# EAGLE design LedMatrixController (EAGLE 6.5.0)
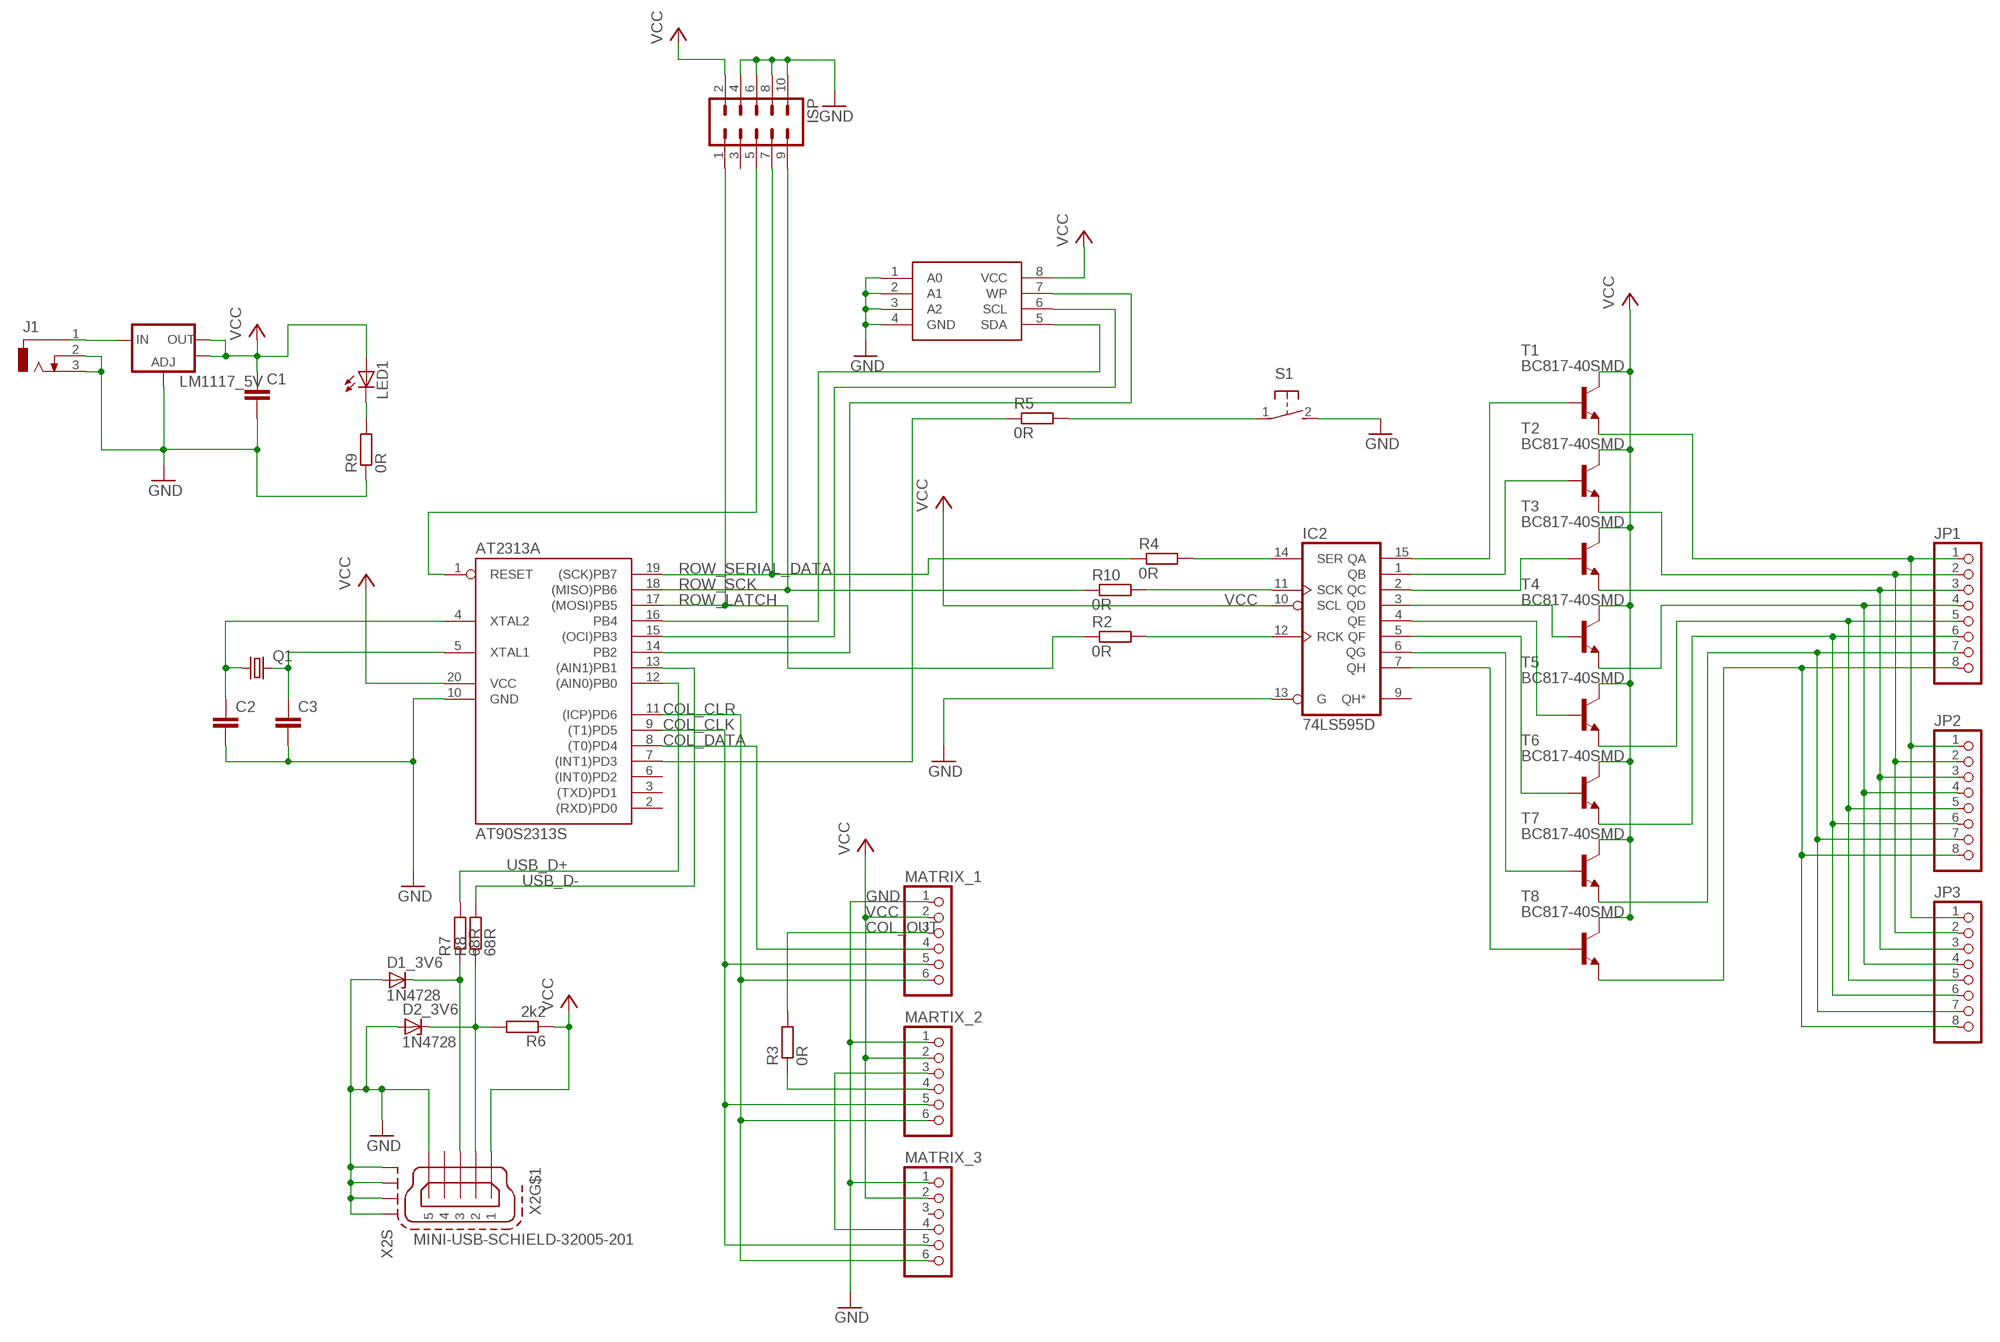
[diagram p0: schematic, sheet 1]

## Parts
AT2313A  AT90S2313S  [SO20L]
C1  C-EU025-025X050  [C025-025X050]
C2  C-EUC1206  [C1206]
C3  C-EUC1206  [C1206]
D1_3V6  1N4728  [DO41Z10]
D2_3V6  1N4728  [DO41Z10]
EEPROM  AT24C08  [SO08]
IC2  74LS595D  [SO16]
ISP  ML10  [ML10]
J1  DCJ0303  [DCJ0303]
JP1  PINHD-1X8  [1X08]
JP2  PINHD-1X8  [1X08]
JP3  PINHD-1X8  [1X08]
LED1  LEDCHIPLED_1206  [CHIPLED_1206]
LM1117_5V  V_REG_LM1117SOT223  [SOT223]
MARTIX_2  PINHD-1X6  [1X06]
MATRIX_1  PINHD-1X6  [1X06]
MATRIX_3  PINHD-1X6  [1X06]
Q1  CRYSTALHC49UP  [HC49UP]
R2  0R  R-EU_R1206  [R1206]
R3  0R  R-EU_R1206  [R1206]
R4  0R  R-EU_R1206  [R1206]
R5  0R  R-EU_R1206  [R1206]
R6  2k2  R-EU_R1206  [R1206]
R7  68R  R-EU_R1206  [R1206]
R8  68R  R-EU_R1206  [R1206]
R9  0R  R-EU_R1206  [R1206]
R10  0R  R-EU_R1206  [R1206]
S1  31-XX  [B3F-31XX]
T1  BC817-40SMD  [SOT23-BEC]
T2  BC817-40SMD  [SOT23-BEC]
T3  BC817-40SMD  [SOT23-BEC]
T4  BC817-40SMD  [SOT23-BEC]
T5  BC817-40SMD  [SOT23-BEC]
T6  BC817-40SMD  [SOT23-BEC]
T7  BC817-40SMD  [SOT23-BEC]
T8  BC817-40SMD  [SOT23-BEC]
X2  MINI-USB-SCHIELD-32005-201  [32005-201]

## Nets
COL_CLK: AT2313A.9((T1)PD5) MARTIX_2.5 MATRIX_1.5 MATRIX_3.5
COL_CLR: AT2313A.11((ICP)PD6) MARTIX_2.6 MATRIX_1.6 MATRIX_3.6
COL_DATA: AT2313A.8((T0)PD4) MATRIX_1.4
COL_OUT: MATRIX_1.3 R3.2
COL_OUT_2: MARTIX_2.4 R3.1
GND: AT2313A.10(GND) C1.2 C2.2 C3.2 D1_3V6.A D2_3V6.A EEPROM.1(A0) EEPROM.2(A1) EEPROM.3(A2) EEPROM.4(GND) IC2.13(G) ISP.4 ISP.6 ISP.8 ISP.10 J1.2 J1.3 LM1117_5V.1(ADJ) MARTIX_2.1 MATRIX_1.1 MATRIX_3.1 R9.1 S1.2(S) X2.5 X2.M1(S:S1) X2.M2(S:S2) X2.M3(S:S3) X2.M4(S:S4)
N$1: AT2313A.4(XTAL2) C2.1 Q1.1
N$2: J1.1 LM1117_5V.3(IN)
N$3: AT2313A.5(XTAL1) C3.1 Q1.2
N$4: AT2313A.7((INT1)PD3) R5.1
N$5: IC2.12(RCK) R2.2
N$6: AT2313A.16(PB4) EEPROM.5(SDA)
N$7: IC2.14(SER) R4.2
N$8: MARTIX_2.3 MATRIX_3.4
N$10: AT2313A.15((OCI)PB3) EEPROM.6(SCL)
N$11: IC2.11(SCK) R10.2
N$12: AT2313A.14(PB2) EEPROM.7(WP)
N$13: AT2313A.1(RESET) ISP.5
N$14: R5.2 S1.1(P)
N$17: LED1.C R9.2
R1: IC2.15(QA) T1.B
R2: IC2.1(QB) T2.B
R3: IC2.2(QC) T3.B
R4: IC2.3(QD) T4.B
R5: IC2.4(QE) T5.B
R6: IC2.5(QF) T6.B
R7: IC2.6(QG) T7.B
R8: IC2.7(QH) T8.B
ROW1: JP1.1 JP2.1 JP3.1 T1.E
ROW2: JP1.2 JP2.2 JP3.2 T2.E
ROW3: JP1.3 JP2.3 JP3.3 T3.E
ROW4: JP1.4 JP2.4 JP3.4 T4.E
ROW5: JP1.5 JP2.5 JP3.5 T5.E
ROW6: JP1.6 JP2.6 JP3.6 T6.E
ROW7: JP1.7 JP2.7 JP3.7 T7.E
ROW8: JP1.8 JP2.8 JP3.8 T8.E
ROW_LATCH: AT2313A.17((MOSI)PB5) ISP.1 R2.1
ROW_SCK: AT2313A.18((MISO)PB6) ISP.9 R10.1
ROW_SERIAL_DATA: AT2313A.19((SCK)PB7) ISP.7 R4.1
USB_D+: AT2313A.12((AIN0)PB0) R7.2
USB_D-: AT2313A.13((AIN1)PB1) R8.2
USB_DATA+: D1_3V6.C R7.1 X2.3
USB_DATA-: D2_3V6.C R6.2 R8.1 X2.2
VCC: AT2313A.20(VCC) C1.1 EEPROM.8(VCC) IC2.10(SCL) ISP.2 LED1.A LM1117_5V.2(OUT) LM1117_5V.4(OUT) MARTIX_2.2 MATRIX_1.2 MATRIX_3.2 R6.1 T1.C T2.C T3.C T4.C T5.C T6.C T7.C T8.C X2.1
Unconnected: AT2313A.2((RXD)PD0) AT2313A.3((TXD)PD1) AT2313A.6((INT0)PD2) IC2.9(QH*) ISP.3 MATRIX_3.3 X2.4

## Power pins joined to a net without a drawn wire
+5V: IC2.16(VCC)
GND: IC2.8(GND)

## Library data of the parts
AT2313A = atmel:AT90S2313: MICROCONTROLLER 2 Kbytes FLASH 128 bytes SRAM 128 bytes EEPROM UART; OC_FARNELL: unknown; OC_NEWARK: unknown
C1-C3 = resistor:C-EU: CAPACITOR, European symbol
D1_3V6 D2_3V6 = diode:1N4728: Z DIODE 3.3 V, 1W, 5 percent
EEPROM = MJ:AT24C08
IC2 = 74xx-us:74*595: 8-bit SHIFT REGISTER, output latch
ISP = con-ml:ML10: HARTING; OC_FARNELL: unknown; OC_NEWARK: unknown
J1 = con-jack:DCJ0303: DC POWER JACK Source: DCJ0303.pdf; OC_FARNELL: unknown; OC_NEWARK: unknown
JP1-JP3 = pinhead:PINHD-1X8: PIN HEADER
LED1 = led:LED: LED OSRAM: - CHIPLED LG R971, LG N971, LY N971, LG Q971, LY Q971, LO R971, LY R971 LH N974, LH R974 LS Q976, LO Q976, LY Q976 LO Q996 - Hyper CHIPLED LW Q18S LB Q993, LB Q99A, LB R99A - SideLED LS A670, LO A670, LY A670, LG A670, LP A670 LB A673, LV A673, LT A673, LW A673 LH A674 LY A675 LS A676, LA A676, LO A676, LY A676, LW A676 LS A679, LY A679, LG A679 - Hyper Micro SIDELED® LS Y876, LA Y876, LO Y876, LY Y876 LT Y87S - SmartLED LW L88C, LW L88S LB L89C, LB L89S, LG L890 LS L89K, LO L89K, LY L89K LS L896, LA L896, LO L896, LY L896 - TOPLED LS T670, LO T670, LY T670, LG T670, LP T670 LSG T670, LSP T670, LSY T670, LOP T670, LYG T670 LG T671, LOG T671, LSG T671 LB T673, LV T673, LT T673, LW T673 LH T674 LS T676, LA T676, LO T676, LY T676, LB T676, LH T676, LSB T676, LW T676 LB T67C, LV T67C, LT T67C, LS T67K, LO T67K, LY T67K, LW E67C LS E67B, LA E67B, LO E67B, LY E67B, LB E67C, LV E67C, LT E67C LW T67C LS T679, LY T679, LG T679 LS T770, LO T770, LY T770, LG T770, LP T770 LB T773, LV T773, LT T773, LW T773 LH T774 LS E675, LA E675, LY E675, LS T675 LS T776, LA T776, LO T776, LY T776, LB T776 LHGB T686 LT T68C, LB T68C - Hyper Mini TOPLED® LB M676 - Mini TOPLED Santana® LG M470 LS M47K, LO M47K, LY M47K Source: http://www.osram.convergy.de LUXEON: - LUMILED® LXK2-PW12-R00, LXK2-PW12-S00, LXK2-PW14-U00, LXK2-PW14-V00 LXK2-PM12-R00, LXK2-PM12-S00, LXK2-PM14-U00 LXK2-PE12-Q00, LXK2-PE12-R00, LXK2-PE12-S00, LXK2-PE14-T00, LXK2-PE14-U00 LXK2-PB12-K00, LXK2-PB12-L00, LXK2-PB12-M00, LXK2-PB14-N00, LXK2-PB14-P00, LXK2-PB14-Q00 LXK2-PR12-L00, LXK2-PR12-M00, LXK2-PR14-Q00, LXK2-PR14-R00 LXK2-PD12-Q00, LXK2-PD12-R00, LXK2-PD12-S00 LXK2-PH12-R00, LXK2-PH12-S00 LXK2-PL12-P00, LXK2-PL12-Q00, LXK2-PL12-R00 Source: www.luxeon.com KINGBRIGHT: KA-3528ASYC Source: www.kingbright.com
LM1117_5V = SparkFun-PowerIC:V_REG_LM1117: Voltage Regulator LM1117 Standard adjustable voltage regulator but in SMD form. Spark Fun Electronics SKU : COM-00595; PROD_ID: VREG-08170
MARTIX_2 MATRIX_1 MATRIX_3 = pinhead:PINHD-1X6: PIN HEADER
Q1 = crystal:CRYSTAL: CRYSTAL; OC_FARNELL: unknown; OC_NEWARK: unknown
R2-R10 = resistor:R-EU_: RESISTOR, European symbol
S1 = switch-omron:31-XX: OMRON SWITCH; MPN: B3F-3100; OC_FARNELL: 959704; OC_NEWARK: 36M3582
T1-T8 = transistor-npn:BC817*: NPN Transistor
X2 = con-cypressindustries:MINI-USB-SCHIELD-: MINI USB-B Conector Source: www.cypressindustries.com; OC_FARNELL: unknown; OC_NEWARK: unknown

## Board
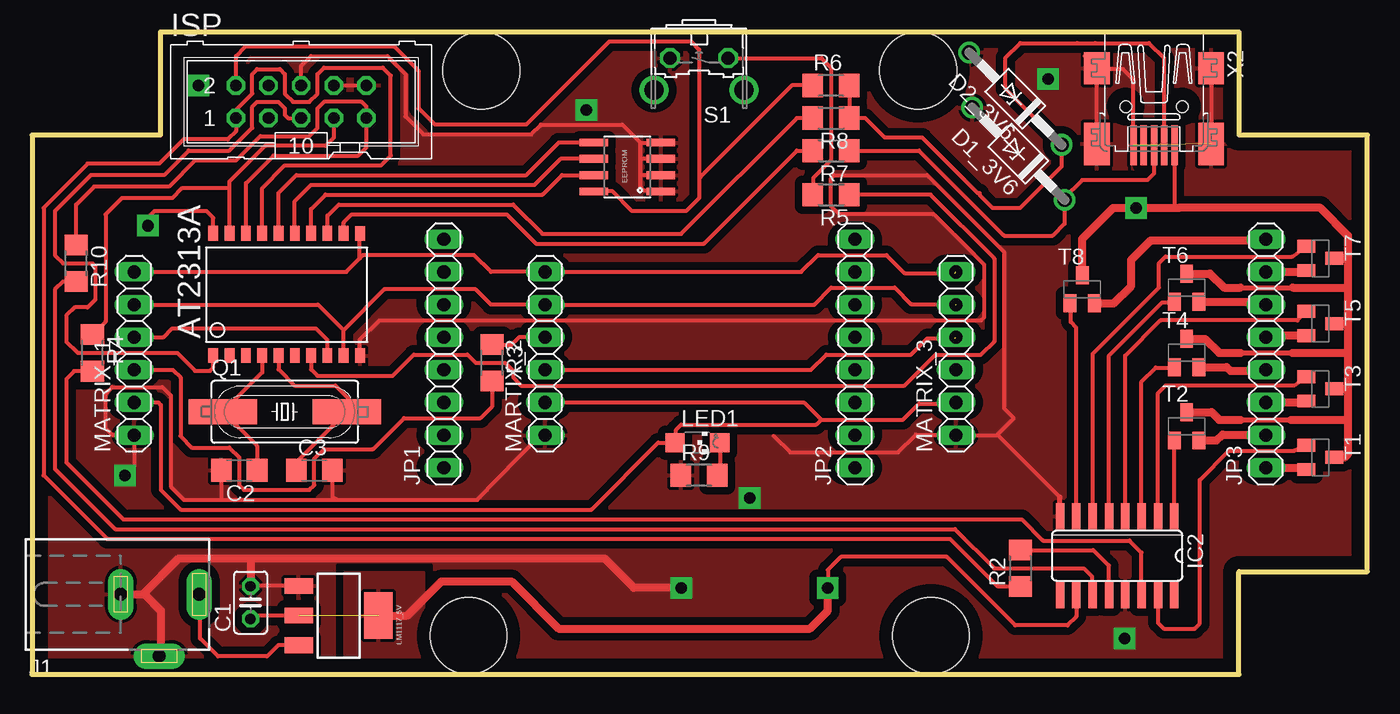
[diagram p1: board, top side]
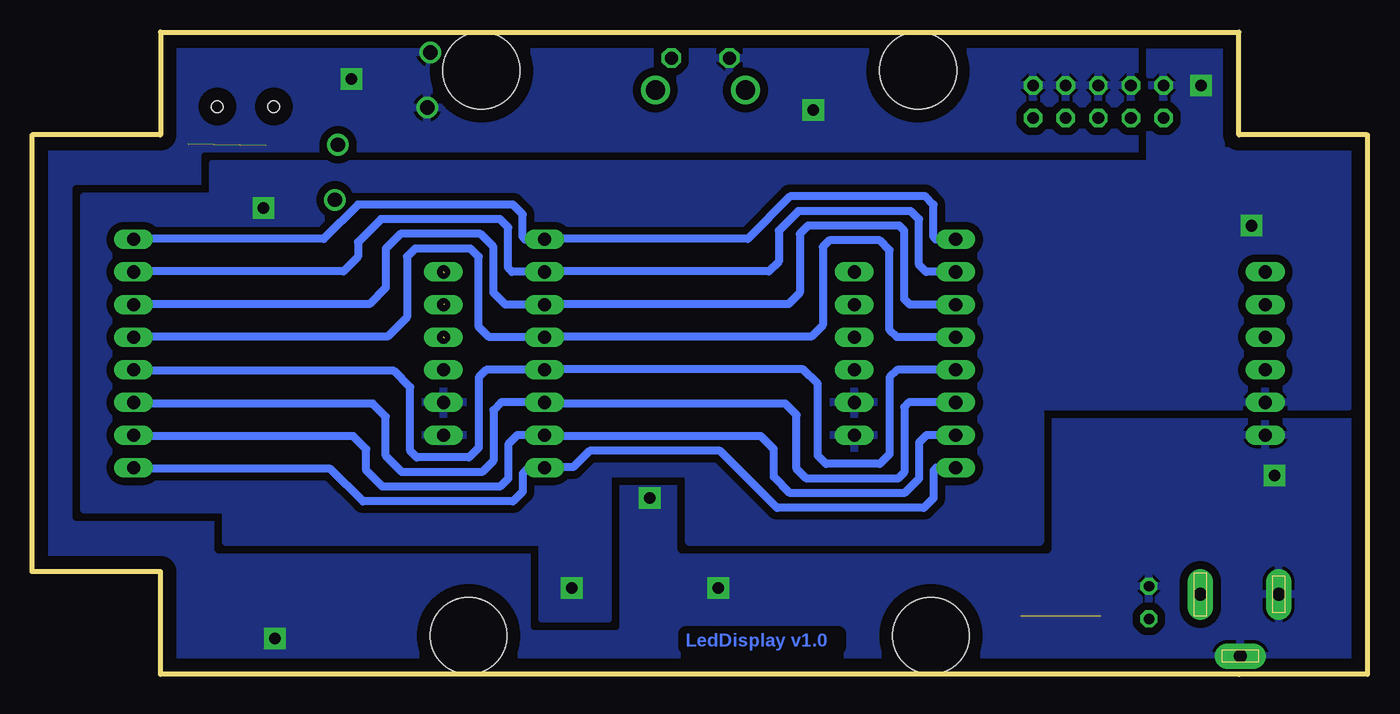
[diagram p2: board, bottom side, seen from below]

Size 104 x 50 mm. Coordinates in mm from the lower left corner, seen from the top.
Outline: 104,8 104,42 94,42 94,50 10,50 10,42 0,42 0,0 10,0 10,0 94,0 94,8 104,8
Copper layers (1*16): Top 0.035mm / dielectric 1.5mm / Bottom 0.035mm
Design rules "default *": minimum track width 10mil, minimum drill 24mil, track to track 12mil, track to pad 12mil, pad to pad 12mil, via to via 12mil, smd to smd 8mil, copper to edge 40mil, drill to drill 20mil, minimum pad ring 10mil, minimum via ring 8mil, stop-mask expansion 4mil, vias tented up to drill 0mil, thermal gap 10mil
Holes 6 mm at 34,3 70,3 69,47 35,47

### Footprints (pad centres in the part's own frame; a part is rotated, then mirrored left to right if it is on the bottom)
SO20L = smd 0.762 x 1.143: 1 -5.08,-5.131; 2 -3.81,-5.131; 3 -2.54,-5.131; 4 -1.27,-5.131; 5 0,-5.131; 6 1.27,-5.131; 7 2.54,-5.131; 8 3.81,-5.131; 9 5.08,-5.131; 10 6.35,-5.131; 11 6.35,4.369; 12 5.08,4.394; 13 3.81,4.394; 14 2.54,4.394; 15 1.27,4.394; 16 0,4.394; 17 -1.27,4.394; 18 -2.54,4.394; 19 -3.81,4.394; 20 -5.08,4.394
C025-025X050 = drill 0.813 octagon: 1 -1.27,0; 2 1.27,0
C1206 = smd 1.6 x 1.8: 1 -1.4,0; 2 1.4,0
DO41Z10 = drill 1.118: A 5.08,0; C -5.08,0
SO08 = smd 0.61 x 2.21: 1 -1.905,-2.616; 2 -0.635,-2.616; 3 0.635,-2.616; 4 1.905,-2.616; 5 1.905,2.616; 6 0.635,2.616; 7 -0.635,2.616; 8 -1.905,2.616
SO16 = smd 0.66 x 2.032: 1 -4.445,-3.073; 2 -3.175,-3.073; 3 -1.905,-3.073; 4 -0.635,-3.073; 5 0.635,-3.073; 6 1.905,-3.073; 7 3.175,-3.073; 8 4.445,-3.073; 9 4.445,3.073; 10 3.175,3.073; 11 1.905,3.073; 12 0.635,3.073; 13 -0.635,3.073; 14 -1.905,3.073; 15 -3.175,3.073; 16 -4.445,3.073
ML10 = drill 0.914 octagon: 1 -5.08,-1.27; 2 -5.08,1.27; 3 -2.54,-1.27; 4 -2.54,1.27; 5 0,-1.27; 6 0,1.27; 7 2.54,-1.27; 8 2.54,1.27; 9 5.08,-1.27; 10 5.08,1.27
DCJ0303 = drill 1 pad 2 long: 1 0,3.1; 2 4.8,0; 3 0,-3
1X08 = drill 1.016 long: 1 -8.89,0; 2 -6.35,0; 3 -3.81,0; 4 -1.27,0; 5 1.27,0; 6 3.81,0; 7 6.35,0; 8 8.89,0
CHIPLED_1206 = smd 1.5 x 1.5: A 0,-1.75; C 0,1.75
SOT223 = smd 1.219 x 2.235: 1 -2.311,-3.099; 2 0,-3.099; 3 2.311,-3.099 | smd 3.6 x 2.2: 4 0,3.099
1X06 = drill 1.016 long: 1 -6.35,0; 2 -3.81,0; 3 -1.27,0; 4 1.27,0; 5 3.81,0; 6 6.35,0
HC49UP = smd 5.334 x 1.93: 1 -4.826,0; 2 4.826,0
R1206 = smd 1.6 x 1.803: 1 -1.422,0; 2 1.422,0
B3F-31XX = drill 1.016 octagon: 1 -2.261,-1.245; 2 2.261,-1.245 | drill 1.499 pad 2.159: 3 -3.505,1.245; 4 3.505,1.245
SOT23-BEC = smd 1 x 1.4: B -0.95,-1.1; C 0,1.1; E 0.95,-1.1
32005-201 = smd 3.1 x 0.5: 1 3,1.6; 2 3,0.8; 3 3,0; 4 3,-0.8; 5 3,-1.6 | smd 2.5 x 2: M1 -3,-4.45; M2 -3,4.45 | smd 3.3 x 2: M3 2.9,4.45; M4 2.9,-4.45 | hole 0.9: 0,2.2; 0,-2.2

### Placement (x,y rotation side)
AT2313A  19.19,29.95 0 top
C1  17.02,5.59 90 top
C2  16.13,15.88 180 top
C3  21.97,15.88 0 top
D1_3V6  76.81,40.54 135 top
D2_3V6  76.58,44.82 135 top
EEPROM  46.35,39.5 90 top
IC2  84.51,9.23 180 top
ISP  20.95,44.58 0 top
J1  9.91,6.22 270 top
JP1  32.07,24.98 90 top
JP2  64.09,24.98 90 top
JP3  96.09,24.98 90 top
LED1  51.82,18.04 270 top
LM1117_5V  23.88,4.57 270 top
MARTIX_2  39.96,24.98 90 top
MATRIX_1  7.95,24.98 90 top
MATRIX_3  71.96,24.98 90 top
Q1  19.68,20.45 0 top
R2  76.96,8.26 90 top
R3  35.81,24.26 270 top
R4  4.7,25.02 270 top
R5  62.23,37.34 180 top
R6  62.23,45.85 0 top
R7  62.23,40.77 180 top
R8  62.23,43.31 180 top
R9  51.94,15.49 0 top
R10  3.43,32 270 top
S1  51.94,46.74 180 top
T1  100.33,16.89 270 top
T2  89.92,19.3 0 top
T3  100.33,22.23 270 top
T4  89.92,25.02 0 top
T5  100.33,27.31 270 top
T6  89.92,30.1 0 top
T7  100.33,32.39 270 top
T8  81.79,29.97 0 top
X2  87.38,44.2 270 top

### Tracks (layer width: path | path; a pad name or v marks a point on that pad's centre or on a via)
COL_CLK  (1 unrouted)
  Top 0.305: 71.92,28.83 68.45,28.83 67.18,30.1 62.23,30.1 60.91,28.79 MARTIX_2.5 35.73,28.79 34.54,29.97 27.43,29.97 24.26,26.8 | MATRIX_1.5 22.27,28.79 24.26,26.8 | AT2313A.9 24.26,24.83 24.26,26.8
COL_CLR  (1 unrouted)
  Top 0.305: 71.88,31.24 67.94,31.24 66.55,32.64 61.21,32.64 59.9,31.33 MARTIX_2.6 35.73,31.33 34.42,32.64 25.78,32.64 25.53,32.39 | MATRIX_1.6 24.47,31.33 25.53,32.39 | 25.53,32.39 25.53,34.3 AT2313A.11
COL_DATA
  Top 0.305: MATRIX_1.4 10.24,26.25 10.92,26.93 22.1,26.93 22.99,26.04 22.99,24.83 AT2313A.8
COL_OUT
  Top 0.305: MATRIX_1.3 10.97,23.71 11.56,23.12 11.56,18.54 12.45,17.65 15.37,17.65 16.13,16.89 16.13,14.73 16.51,14.35 21.59,14.35 21.97,14.73 21.97,16.77 22.73,17.53 26.54,17.53 28.96,19.94 34.92,19.94 35.81,20.83 R3.2
COL_OUT_2
  Top 0.305: MARTIX_2.4 37.93,26.25 37.34,25.66 36.09,25.66 36.07,25.68 R3.1
GND  (via drill 0.9 pad 1.68)  (1 unrouted)
  Top 0.305: 6.22,18.67 6.35,18.67 | 6.35,18.67 7.91,18.67 MATRIX_1.1 7.95,16.21 v7.24,15.49 | LM1117_5V.1 17.04,6.88 C1.2 | AT2313A.10 25.53,24.8 25.53,26.04 27.05,27.56 73.91,27.56 74.17,27.81 74.17,31.88 70.23,35.81 62.87,35.81 62.23,36.45 62.23,38.61 62.48,38.86 69.72,38.86 75.69,32.89 75.69,20.7 76.45,19.94 75.14,18.62 | ISP.8 ISP.10 | 80.06,13.79 75.23,18.62 75.14,18.62 | MARTIX_2.1 39.58,18.62 34.67,13.59 23.75,13.59 | 14.86,13.59 11.81,13.59 10.79,14.61 10.79,21.72 10.16,22.35 6.22,22.35 5.71,21.85 5.71,19.18 6.27,18.62 6.3,18.62 6.35,18.67 | 14.86,13.59 23.75,13.59 | C2.2 14.73,13.72 14.86,13.59 | C3.2 23.37,13.84 23.75,13.59 | ISP.6 20.95,47.37 21.72,48.13 27.69,48.13 29.08,46.74 29.08,43.43 30.48,42.04 38.86,42.04 39.62,42.8 45.97,42.8 47.37,41.4 | 81.99,48.13 X2.M1 | X2.M2 X2.M3 | EEPROM.1 48.9,37.67 47.68,37.67 47.37,37.97 47.37,38.99 | 47.37,41.4 EEPROM.4 | 47.37,38.99 47.37,40.26 | 47.37,40.26 47.37,41.4 | EEPROM.3 47.5,40.13 47.37,40.26 | EEPROM.2 47.5,38.86 47.37,38.99 | X2.5 85.78,46.3 84.96,47.12 83,47.12 X2.M1 | X2.M4 X2.M1 | 75.14,18.62 MATRIX_3.1 71.92,18.67 68.83,18.67 67.44,17.27 59.05,17.27 57.76,18.57
  Top 0.406: IC2.8 80.06,13.79
  Top 0.61: J1.2 10.03,1.55 10.03,4.95 8.76,6.22 J1.3 8.64,6.22 11.43,9.02 16.89,9.02 | 16.89,9.02 44.58,9.02 46.86,6.73 v50.55,6.73 | 17.04,6.88 17.04,8.87 16.89,9.02
  other vias: 85.09,2.79 43.18,43.94 79.12,46.36 55.88,13.72
  pour Bottom (isolate 0.61, rank 6): 0.25,49.66 0.38,49.66 0.38,0.51 103.5,0.51 103.5,50.04 0.25,50.04
  pour Top (isolate 0.61, rank 6): 0.13,50.29 0.13,0.13 104.27,0.13 104.27,50.04
N$1
  Top 0.305: AT2313A.4 17.92,23.51 Q1.1 17.53,17.78 C2.1
N$2
  Top 0.305: LM1117_5V.3 19.15,2.26 18.29,1.4 14.48,1.4 13.08,2.79 13.08,6.86 12.95,6.99 12.95,6.17 | 12.95,5.72 12.95,6.17 | 12.95,6.17 J1.1
N$3
  Top 0.305: AT2313A.5 19.19,23.73 20.45,22.48 23.62,22.48 24.77,21.34 24.77,20.7 Q1.2 | 24.64,20.32 Q1.2 | C3.1 20.57,16.51 Q1.2
N$4
  Top 0.305: AT2313A.7 21.73,23.73 22.23,23.24 28.07,23.24 29.72,24.89 33.91,24.89 34.54,24.26 36.83,24.26 37.47,23.62 37.47,23.12 38.1,22.48 67.94,22.48 70.36,24.89 73.91,24.89 74.93,25.91 74.93,32.39 69.98,37.34 R5.1
N$5
  Top 0.305: R2.2 82.65,9.68 83.87,8.46 IC2.12
N$6
  Top 0.305: AT2313A.16 19.19,37.48 20.57,38.86 38.48,38.86 41.02,41.4 EEPROM.5
N$7
  Top 0.305: R4.2 3.28,23.6 2.67,22.99 2.67,16.51 7.11,12.07 77.09,12.07 78.74,10.41 85.47,10.41 86.41,9.47 IC2.14
N$8  (1 unrouted)
  Top 0.305: MARTIX_2.3 60.66,23.71 61.85,24.89 68.45,24.89 69.72,26.16 71.88,26.16
N$10
  Top 0.305: AT2313A.15 20.46,36.85 21.72,38.1 39.12,38.1 41.15,40.13 EEPROM.6
N$11
  Top 0.305: R10.2 2.39,30.58 1.78,29.97 1.78,16 6.48,11.3 71.88,11.3 74.93,8.26 81.92,8.26 82.55,7.62 82.55,6.21 IC2.11
N$12
  Top 0.305: AT2313A.14 21.73,36.21 22.86,37.34 39.75,37.34 41.27,38.86 EEPROM.7
N$13
  Top 0.305: AT2313A.1 14.1,24.8 14.1,23.88 13.84,23.62 12.7,23.62 11.3,25.02 3.56,25.02 2.67,25.91 2.67,27.94 3.3,28.58 4.32,28.58 4.95,29.21 4.95,31.75 4.7,32 2.41,32 1.78,32.64 1.78,36.07 4.57,38.86 10.29,38.86 12.19,40.77 15.37,40.77 17.14,42.55 17.14,44.2 17.53,44.58 19.18,44.58 19.68,44.07 19.68,43.56 19.94,43.31 ISP.5
N$14
  Top 0.305: R5.2 60.83,37.36 60.83,38.61 62.23,40.01 62.23,47.24 61.49,47.98 S1.1
N$17
  Top 0.305: LED1.C 53.57,15.7 R9.2
R1
  Top 0.305: IC2.15 87.68,4.01 88.14,3.56 90.55,3.56 90.93,3.94 90.93,15.11 93.22,17.4 98.28,17.4 T1.B
R2
  Top 0.305: IC2.1 88.95,18.19 T2.B
R3
  Top 0.305: IC2.2 87.68,21.9 88.27,22.48 98.28,22.48 T3.B
R4
  Top 0.305: IC2.3 86.41,22.79 87.5,23.88 88.92,23.88 T4.B
R5
  Top 0.305: IC2.4 85.14,24.82 87.88,27.56 98.55,27.56 98.98,27.98
  Top 0.406: T5.B 98.98,27.98
R6
  Top 0.305: IC2.5 83.87,24.82 88.01,28.96 88.8,28.96 T6.B
R7
  Top 0.305: T7.B 98.15,32.51 88.27,32.51 87.76,32 87.76,30.1 82.6,24.94 IC2.6
R8
  Top 0.305: IC2.7 81.33,27 80.9,27.43 80.9,28.81 T8.B
ROW1
  Top 0.61: JP3.1 98.86,16.09 T1.E
  Bottom 0.61: 63.45,16.09 63.5,16.13 | 63.5,16.13 64.04,16.13 JP2.1 | JP1.1 33.57,16.09 33.78,15.88 33.78,13.72 34.54,12.96 45.97,12.96 50.42,17.4 60.58,17.4 61.85,16.13 63.5,16.13 | 64,16 JP2.1 | JP2.1 65.32,16.09 65.79,15.62 65.79,14.22 66.55,13.46 78.23,13.46 80.77,16 96.01,16 JP3.1
ROW2
  Top 0.61: T2.E 92.25,18.21 92.71,18.67 96.05,18.67 JP3.2
  Bottom 0.61: 64.04,18.67 JP2.2 | JP1.2 34.34,18.62 34.92,18.04 34.92,15.24 36.07,14.1 44.96,14.1 46.23,15.37 46.23,17.53 47.24,18.54 64,18.54 JP2.2 | JP2.2 66.21,18.62 66.93,17.91 66.93,15.24 67.56,14.61 76.71,14.61 77.98,15.88 77.98,17.53 78.99,18.54 96.01,18.54 JP3.2
ROW3
  Top 0.61: JP3.3 98.86,21.17 T3.E
  Bottom 0.61: JP2.3 64.01,21.17 | 64.04,21.21 JP2.3 | JP1.3 35.73,21.17 36.07,20.83 36.07,15.75 36.58,15.24 43.69,15.24 44.45,16 44.45,20.19 45.34,21.08 64,21.08 JP2.3 | JP2.3 67.48,21.17 68.07,20.58 68.07,16.64 68.96,15.75 75.18,15.75 76.45,17.02 76.45,20.07 77.47,21.08 96.01,21.08 JP3.3
ROW4
  Top 0.61: 96.05,23.75 JP3.4 | 96.04,23.76 JP3.4 | T4.E 93.05,23.92 93.34,23.62 96.01,23.62 JP3.4
  Bottom 0.61: JP1.4 36.62,23.71 37.21,23.12 37.21,17.15 37.97,16.38 42.16,16.38 42.8,17.02 42.8,22.61 43.94,23.75 64.04,23.75 JP2.4 68.62,23.71 69.22,23.12 69.22,17.65 69.98,16.89 74.04,16.89 74.55,17.4 74.55,22.35 75.82,23.62 96.01,23.62 JP3.4
ROW5
  Top 0.61: T5.E 96.2,26.36 JP3.5
  Bottom 0.61: JP1.5 36.66,26.25 37.21,26.8 37.21,33.02 37.97,33.78 41.91,33.78 42.42,33.27 42.42,27.18 43.31,26.29 64.04,26.29 JP2.5 68.41,26.25 69.22,27.05 69.22,32.51 69.85,33.15 74.17,33.15 74.8,32.51 74.8,27.81 76.33,26.29 96.05,26.29 JP3.5
ROW6
  Top 0.61: T6.E 95.88,29 JP3.6
  Bottom 0.61: JP1.6 35.64,28.79 36.07,29.21 36.07,34.54 36.45,34.93 43.56,34.93 44.2,34.29 44.2,29.72 45.09,28.83 64.04,28.83 JP2.6 67.14,28.79 68.07,29.72 68.07,33.27 69.09,34.29 75.31,34.29 76.45,33.15 76.45,30.1 77.72,28.83 96.05,28.83 JP3.6
ROW7
  Top 0.61: 96.01,31.24 JP3.7 98.86,31.33 T7.E
  Bottom 0.61: JP1.7 34.37,31.33 34.92,31.88 34.92,35.43 35.56,36.07 44.32,36.07 45.85,34.54 45.85,32.13 46.61,31.37 64.04,31.37 JP2.7 66.63,31.33 66.93,31.62 66.93,34.8 67.56,35.43 76.83,35.43 78.61,33.66 78.61,32.51 79.76,31.37 96.05,31.37 JP3.7
ROW8
  Top 0.61: T8.E 84.24,28.87 85.6,30.23 85.6,32.26 87.12,33.78 96.01,33.78 JP3.8
  Bottom 0.61: JP1.8 33.61,33.86 33.78,34.04 33.78,36.58 34.42,37.21 44.96,37.21 48.26,33.91 64.04,33.91 JP2.8 65.61,33.86 65.79,34.04 65.79,35.81 66.55,36.58 78.61,36.58 81.28,33.91 96.05,33.91 JP3.8
ROW_LATCH
  Top 0.305: AT2313A.17 17.92,37.86 19.68,39.62 27.18,39.62 27.94,40.39 27.94,46.61 27.3,47.24 22.73,47.24 22.23,46.74 22.23,45.21 21.59,44.58 20.32,44.58 19.68,45.21 19.68,46.74 19.3,47.12 17.53,47.12 17.14,46.74 17.14,45.21 15.88,43.94 ISP.1 15.88,42.29 15.24,41.66 11.81,41.66 9.91,39.75 4.32,39.75 0.89,36.32 0.89,15.49 5.84,10.54 71.5,10.54 75.18,6.86 76.94,6.86 R2.1
ROW_SCK
  Top 0.305: R10.1 3.43,36.58 4.83,37.97 10.67,37.97 12.7,40.01 15.88,40.01 17.78,41.91 21.59,41.91 22.23,42.55 22.23,44.07 22.73,44.58 25.65,44.58 26.04,44.2 ISP.9 26.04,41.02 25.4,40.39 18.8,40.39 16.65,38.24 AT2313A.18
ROW_SERIAL_DATA
  Top 0.305: AT2313A.19 15.38,37.83 | 15.38,37.83 11.67,37.83 10.92,37.09 6.99,37.09 5.71,35.81 5.71,27.46 R4.1 4.7,26.54 4.57,26.67 4.45,26.67 | ISP.7 23.5,41.78 22.86,41.15 18.16,41.15 15.37,38.35 15.37,37.85 15.38,37.83
USB_D+
  Top 0.305: AT2313A.12 24.27,35.2 24.89,35.81 36.96,35.81 39.24,33.53 52.32,33.53 59.56,40.77 R7.2
USB_D-
  Top 0.305: AT2313A.13 23,35.7 23.88,36.58 37.47,36.58 39.75,34.29 50.55,34.29 59.56,43.31 R8.2
USB_DATA+
  Top 0.305: R7.1 69.09,40.77 75.69,34.16 79.5,34.16 80.41,35.07 D1_3V6.C 80.41,37.1 81.79,38.48 86.87,38.48 87.38,38.99 X2.3
USB_DATA-
  Top 0.305: R6.2 R8.1 64.9,43.31 66.42,41.78 69.34,41.78 73.66,37.47 73.79,37.47 73.79,37.34 74.8,36.32 76.96,36.32 80.17,39.53 D2_3V6.C 80.26,41.32 80.09,41.32 75.82,45.59 75.82,48.01 76.96,49.15 81.41,49.15 82.8,49.15 87,49.15 88.18,47.97 X2.2
VCC  (via drill 0.9 pad 1.68)  (1 unrouted)
  Top 0.305: ISP.2 15.88,48.13 16.64,48.9 28.19,48.9 30.1,46.99 30.1,44.07 31.37,42.8 38.48,42.8 44.96,49.28 51.31,49.28 51.94,48.64 51.94,38.74 | MATRIX_1.2 9.82,21.17 10.03,20.96 10.03,14.35 11.56,12.83 43.56,12.83 48.77,18.04 LED1.A 50.16,18.04 50.16,19.05 50.55,19.43 61.09,19.43 61.47,19.81 | LM1117_5V.2 17.27,4.57 C1.1 | IC2.10 81.33,4.5 80.64,3.81 76.58,3.81 71.25,9.14 62.99,9.14 61.98,8.13 v61.98,6.73 | X2.1 88.98,36.63 89.28,36.32 | EEPROM.8 45.21,37.59 46.74,36.07 50.93,36.07 51.94,37.09 51.94,38.74 | MARTIX_2.2 60.12,21.17 61.47,19.81 | 61.47,19.81 67.82,19.81 69.09,21.08 71.88,21.08 MATRIX_3.2 | AT2313A.20 14.11,35.54 13.59,36.07 9.53,36.07 8.89,35.43 8.89,35.05 v9.02,34.93 | R6.1 59.18,45.85 52.07,38.74 51.94,38.74
  Top 0.406: 94.11,19.81 98.04,19.81 | 94.11,25.02 98.17,25.02 | 92.84,30.1 98.17,30.1
  Top 0.61: LM1117_5V.4 29.21,4.57 31.88,7.24 37.34,7.24 41.02,3.56 60.58,3.56 61.98,4.95 v61.98,6.73 | T6.C 91.74,31.2 92.84,30.1 94.11,30.1 | T4.C 91.36,26.12 92.46,25.02 94.11,25.02 | T2.C 91.86,20.41 92.46,19.81 94.11,19.81 | 98.17,25.02 102.49,25.02 | 98.04,19.81 102.36,19.81 102.49,19.94 | 98.17,30.1 102.36,30.1 102.49,30.23 | T8.C 81.79,33.91 84.2,36.32 v85.98,36.32 89.28,36.32 100.33,36.32 102.49,34.16 102.49,32.51 | 102.49,32.51 102.49,30.23 | 102.49,30.23 102.49,27.18 | 102.49,27.18 102.49,25.02 | 102.49,25.02 102.49,22.1 | 102.49,22.1 102.49,19.94 | 102.49,19.94 102.49,17.15 102.23,16.89 T1.C | T3.C 102.36,22.23 102.49,22.1 | T5.C 102.36,27.31 102.49,27.18 | T7.C 102.36,32.39 102.49,32.51
  other vias: 12.95,45.85
  pour Bottom (isolate 0.61): 11.43,48.77 11.43,40.77 1.52,40.77 1.52,20.83 89.92,20.83 89.92,39.75 16.89,39.75 16.89,48.77
  pour Bottom (isolate 0.61): 25.53,37.21 25.53,10.29 52.83,10.29 52.83,15.62 59.18,15.62 59.18,4.32 64.26,4.32 64.26,10.29 88.9,10.29 88.9,12.83 99.95,12.83 99.95,37.21
  pour Top (isolate 0.61): 24.38,7.88 24.38,1.27 30.48,1.27 30.48,7.88

### Text on the board
Bottom: LedDisplay v1.0